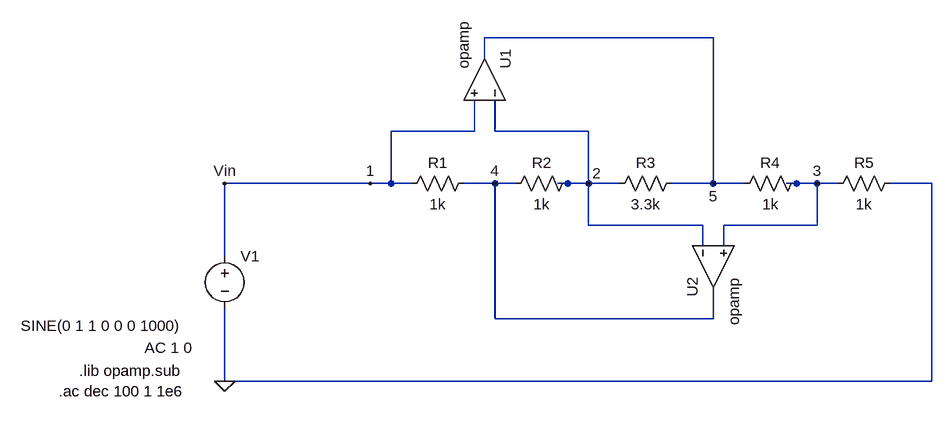
[diagram p0: schematic conversor.asc]
conversor.asc, the LTspice schematic file:
Version 4
SHEET 1 880 680
WIRE 448 -48 96 -48
WIRE 96 -16 96 -48
WIRE 80 96 80 48
WIRE 80 96 -48 96
WIRE 112 96 112 48
WIRE 256 96 112 96
WIRE -80 176 -304 176
WIRE -48 176 -48 96
WIRE -48 176 -80 176
WIRE -16 176 -48 176
WIRE 112 176 64 176
WIRE 144 176 112 176
WIRE 224 176 208 176
WIRE 256 176 256 96
WIRE 256 176 224 176
WIRE 304 176 256 176
WIRE 448 176 448 -48
WIRE 448 176 384 176
WIRE 496 176 448 176
WIRE 576 176 560 176
WIRE 608 176 576 176
WIRE 640 176 608 176
WIRE 784 176 720 176
WIRE 256 240 256 176
WIRE 432 240 256 240
WIRE 608 240 608 176
WIRE 608 240 464 240
WIRE 432 272 432 240
WIRE 464 272 464 240
WIRE -304 288 -304 176
WIRE 112 384 112 176
WIRE 448 384 448 336
WIRE 448 384 112 384
WIRE -304 480 -304 368
WIRE 784 480 784 176
WIRE 784 480 -304 480
FLAG -304 480 0
FLAG -304 176 Vin
FLAG -80 176 1
FLAG 256 176 2
FLAG 608 176 3
FLAG 112 176 4
FLAG 448 176 5
SYMBOL res 80 160 R90
WINDOW 0 0 56 VBottom 2
WINDOW 3 32 56 VTop 2
SYMATTR InstName R1
SYMATTR Value 1k
SYMBOL res 240 160 R90
WINDOW 0 0 56 VBottom 2
WINDOW 3 32 56 VTop 2
SYMATTR InstName R2
SYMATTR Value 1k
SYMBOL res 592 160 R90
WINDOW 0 0 56 VBottom 2
WINDOW 3 32 56 VTop 2
SYMATTR InstName R4
SYMATTR Value 1k
SYMBOL Opamps\\opamp 160 16 M270
SYMATTR InstName U1
SYMATTR SpiceLine Aol=1000K
SYMATTR SpiceLine2 GBW=100Meg
SYMBOL Opamps\\opamp 384 304 M90
SYMATTR InstName U2
SYMATTR SpiceLine Aol=1000K
SYMATTR SpiceLine2 GBW=100Meg
SYMBOL voltage -304 272 R0
WINDOW 3 -314 123 Left 2
WINDOW 123 -123 157 Left 2
WINDOW 39 0 0 Left 0
SYMATTR Value SINE(0 1 1 0 0 0 1000)
SYMATTR Value2 AC 1 0
SYMATTR InstName V1
SYMBOL res 400 160 R90
WINDOW 0 0 56 VBottom 2
WINDOW 3 32 56 VTop 2
SYMATTR InstName R3
SYMATTR Value 3.3k
SYMBOL res 736 160 R90
WINDOW 0 0 56 VBottom 2
WINDOW 3 32 56 VTop 2
SYMATTR InstName R5
SYMATTR Value 1k
TEXT -528 464 Left 2 !.lib opamp.sub
TEXT -560 496 Left 2 !.ac dec 100 1 1e6

The netlist it stands for:
* conversor.asc
R1 4 1 1k
R2 2 4 1k
R4 3 5 1k
XU1 2 1 5 opamp Aol=1000K GBW=100Meg  ; pins invin noninvin out
XU2 2 3 4 opamp Aol=1000K GBW=100Meg  ; pins invin noninvin out
V1 1 0 SINE(0 1 1 0 0 0 1000) AC 1 0
R3 5 2 3.3k
R5 0 3 1k
.lib opamp.sub
.ac dec 100 1 1e6
.backanno
.end